# EAGLE design CH340E (EAGLE 9.6.2)
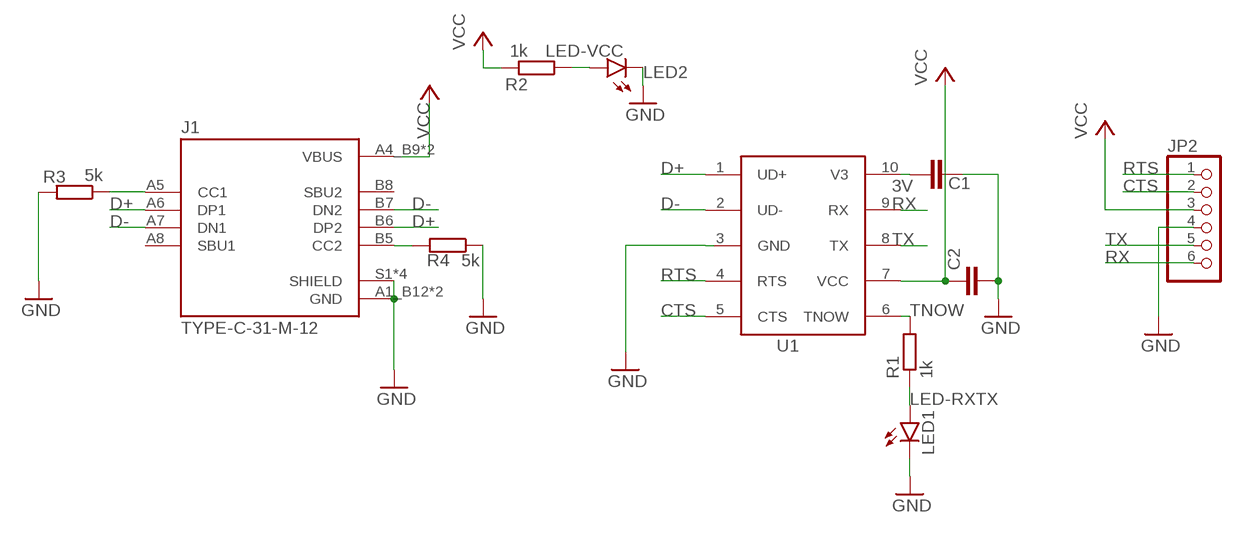
[diagram p0: schematic, sheet 1]

## Parts
C1  C-EUC0603  [C0603]
C2  C-EUC0603  [C0603]
J1  TYPE-C-31-M-12  [HRO_TYPE-C-31-M-12]
JP2  PINHD-1X6  [1X06]
LED1  LEDCHIPLED_0603  [CHIPLED_0603]
LED2  LEDCHIPLED_0603  [CHIPLED_0603]
R1  1k  R-EU_R0603  [R0603]
R2  1k  R-EU_R0603  [R0603]
R3  5k  R-EU_R0603  [R0603]
R4  5k  R-EU_R0603  [R0603]
U1  CH340ESMD  [MSOP10]

## Nets
3V: C1.1 U1.10(V3)
CTS: JP2.2 U1.5(CTS)
D+: J1.A6(DP1) J1.B6(DP2) U1.1(UD+)
D-: J1.A7(DN1) J1.B7(DN2) U1.2(UD-)
GND: C1.2 C2.2 J1.A1_B12(GND) J1.B1_A12(GND) J1.S1(SHIELD) J1.S2(SHIELD) J1.S3(SHIELD) J1.S4(SHIELD) JP2.4 LED1.C LED2.C R3.2 R4.1 U1.3(GND)
LED-RXTX: LED1.A R1.1
LED-VCC: LED2.A R2.1
N$1: J1.A5(CC1) R3.1
N$2: J1.B5(CC2) R4.2
RTS: JP2.1 U1.4(RTS)
RX: JP2.6 U1.9(RX)
TNOW: R1.2 U1.6(TNOW)
TX: JP2.5 U1.8(TX)
VCC: C2.1 J1.A4_B9(VBUS) J1.B4_A9(VBUS) JP2.3 R2.2 U1.7(VCC)
Unconnected: J1.A8(SBU1) J1.B8(SBU2)

## Library data of the parts
C1 C2 = rcl:C-EU: CAPACITOR, European symbol; SPICEPREFIX: C
J1 = TYPE-C-31-M-12:TYPE-C-31-M-12: Check availability <https://pricing.snapeda.com/parts/TYPE-C-31-M-12/HRO%20Electronics%20Co.%2C%20Ltd./view-part?ref=eda>; AVAILABILITY: Not in stock; DESCRIPTION: USB Connectors 24 Receptacle 1 8.94*7.3mm RoHS; MF: HRO Electronics Co., Ltd.; MP: TYPE-C-31-M-12; PACKAGE: Package; PRICE: None
JP2 = pinhead:PINHD-1X6: PIN HEADER
LED1 LED2 = led:LED: LED OSRAM: - CHIPLED LG R971, LG N971, LY N971, LG Q971, LY Q971, LO R971, LY R971 LH N974, LH R974 LS Q976, LO Q976, LY Q976 LO Q996 - Hyper CHIPLED LW Q18S LB Q993, LB Q99A, LB R99A - SideLED LS A670, LO A670, LY A670, LG A670, LP A670 LB A673, LV A673, LT A673, LW A673 LH A674 LY A675 LS A676, LA A676, LO A676, LY A676, LW A676 LS A679, LY A679, LG A679 - Hyper Micro SIDELED® LS Y876, LA Y876, LO Y876, LY Y876 LT Y87S - SmartLED LW L88C, LW L88S LB L89C, LB L89S, LG L890 LS L89K, LO L89K, LY L89K LS L896, LA L896, LO L896, LY L896 - TOPLED LS T670, LO T670, LY T670, LG T670, LP T670 LSG T670, LSP T670, LSY T670, LOP T670, LYG T670 LG T671, LOG T671, LSG T671 LB T673, LV T673, LT T673, LW T673 LH T674 LS T676, LA T676, LO T676, LY T676, LB T676, LH T676, LSB T676, LW T676 LB T67C, LV T67C, LT T67C, LS T67K, LO T67K, LY T67K, LW E67C LS E67B, LA E67B, LO E67B, LY E67B, LB E67C, LV E67C, LT E67C LW T67C LS T679, LY T679, LG T679 LS T770, LO T770, LY T770, LG T770, LP T770 LB T773, LV T773, LT T773, LW T773 LH T774 LS E675, LA E675, LY E675, LS T675 LS T776, LA T776, LO T776, LY T776, LB T776 LHGB T686 LT T68C, LB T68C - Hyper Mini TOPLED® LB M676 - Mini TOPLED Santana® LG M470 LS M47K, LO M47K, LY M47K Source: http://www.osram.convergy.de LUXEON: - LUMILED® LXK2-PW12-R00, LXK2-PW12-S00, LXK2-PW14-U00, LXK2-PW14-V00 LXK2-PM12-R00, LXK2-PM12-S00, LXK2-PM14-U00 LXK2-PE12-Q00, LXK2-PE12-R00, LXK2-PE12-S00, LXK2-PE14-T00, LXK2-PE14-U00 LXK2-PB12-K00, LXK2-PB12-L00, LXK2-PB12-M00, LXK2-PB14-N00, LXK2-PB14-P00, LXK2-PB14-Q00 LXK2-PR12-L00, LXK2-PR12-M00, LXK2-PR14-Q00, LXK2-PR14-R00 LXK2-PD12-Q00, LXK2-PD12-R00, LXK2-PD12-S00 LXK2-PH12-R00, LXK2-PH12-S00 LXK2-PL12-P00, LXK2-PL12-Q00, LXK2-PL12-R00 Source: www.luxeon.com KINGBRIGHT: KA-3528ASYC Source: www.kingbright.com
R1-R4 = rcl:R-EU_: RESISTOR, European symbol; SPICEPREFIX: R
U1 = CH340E:CH340E: WCH.CN/CH340E See DataSheet： wch.cn <http://www.wch.cn/downloads/CH340DS1_PDF.html>

## Board
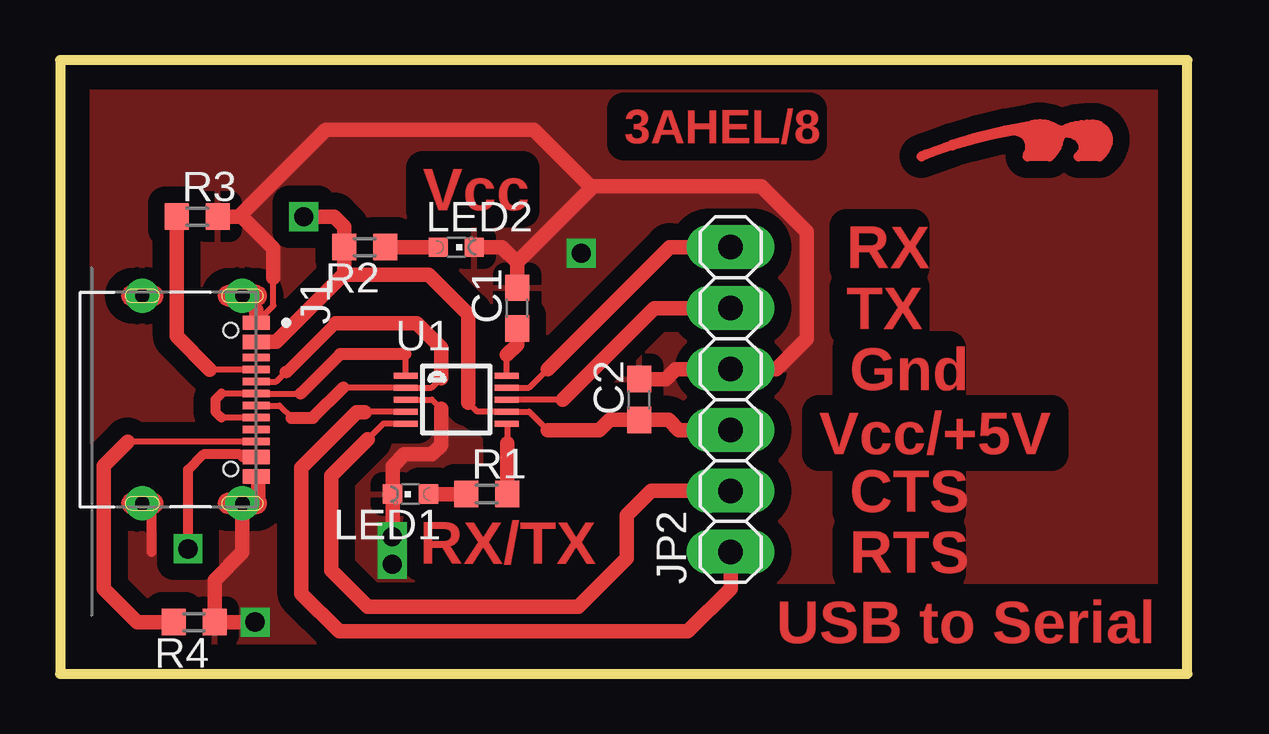
[diagram p1: board, top side]
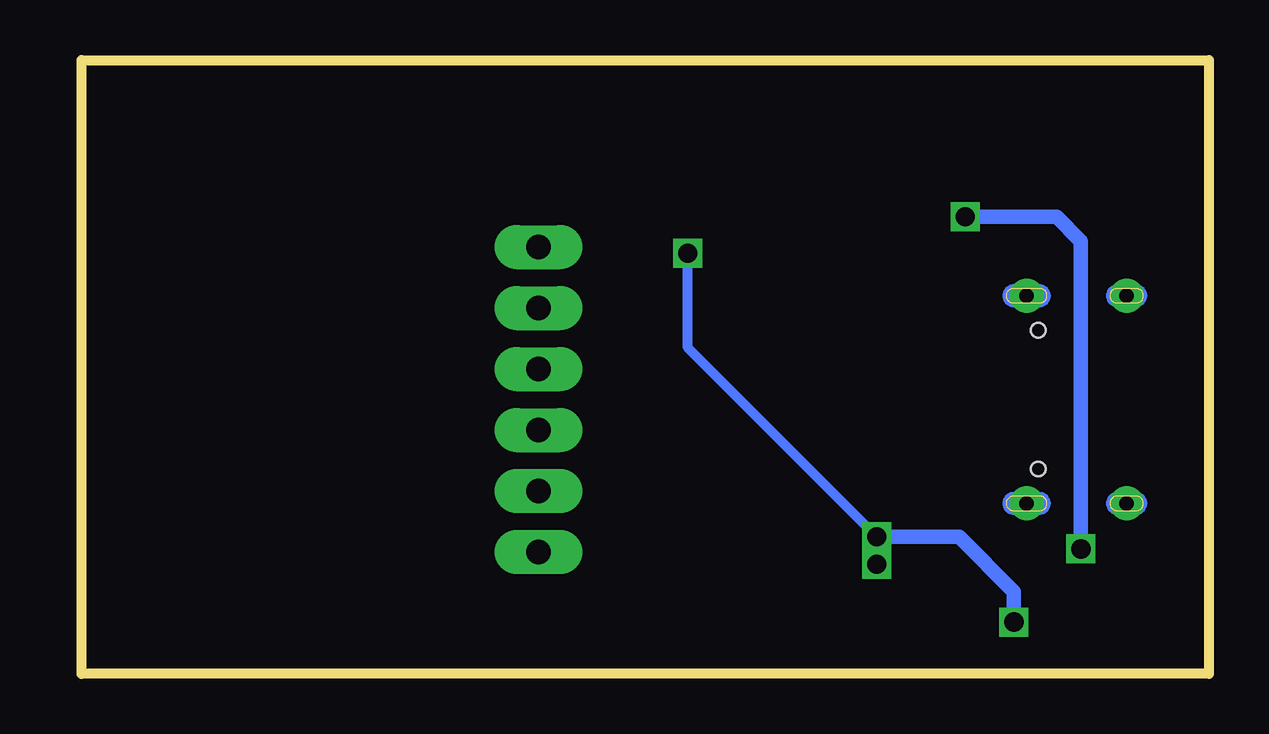
[diagram p2: board, bottom side, seen from below]

Size 46.97 x 25.58 mm. Coordinates in mm from the lower left corner, seen from the top.
Outline: 0,0 46.97,0 46.97,25.58 0,25.58 0,0
Copper layers (1*16): Top 0.035mm / dielectric 1.5mm / Bottom 0.035mm
Design rules "htl-klu *": minimum track width 16mil, minimum drill 0.35mm, track to track 8mil, track to pad 8mil, pad to pad 8mil, via to via 8mil, smd to smd 6mil, copper to edge 40mil, drill to drill 6mil, minimum pad ring 16mil, minimum via ring 8mil, stop-mask expansion 4mil, vias tented up to drill 0mil, thermal gap 20mil

### Footprints (pad centres in the part's own frame; a part is rotated, then mirrored left to right if it is on the bottom)
C0603 = smd 1.1 x 1: 1 -0.85,0; 2 0.85,0
HRO_TYPE-C-31-M-12 = smd 0.6 x 1.14: A1_B12 -3.2,4.75; A4_B9 -2.4,4.75; B1_A12 3.2,4.75; B4_A9 2.4,4.75 | smd 0.3 x 1.14: A5 -1.25,4.75; A6 -0.25,4.75; A7 0.25,4.75; A8 1.25,4.75; B5 1.75,4.75; B6 0.75,4.75; B7 -0.75,4.75; B8 -1.75,4.75 | drill 0.6 pad 0.9: S1 -4.325,4.17; S2 4.325,4.17; S3 -4.325,0; S4 4.325,0 | hole 0.6: -2.89,3.68; 2.89,3.68
1X06 = drill 1.016 long: 1 -6.35,0; 2 -3.81,0; 3 -1.27,0; 4 1.27,0; 5 3.81,0; 6 6.35,0
CHIPLED_0603 = smd 0.8 x 0.8: A 0,-0.75; C 0,0.75
R0603 = smd 1 x 1.1: 1 -0.85,0; 2 0.85,0
MSOP10 = smd 1 x 0.25: 1 -2.113,1; 2 -2.113,0.5; 3 -2.113,0; 4 -2.113,-0.5; 5 -2.113,-1; 6 2.113,-1; 7 2.113,-0.5; 8 2.113,0; 9 2.113,0.5; 10 2.113,1

### Placement (x,y rotation side)
C1  19.05,15.24 90 top
C2  24.13,11.43 90 top
J1  3.43,11.43 270 top
JP2  27.94,11.43 90 top
LED1  14.61,7.49 90 top
LED2  16.51,17.78 270 top
R1  17.78,7.49 0 top
R2  12.7,17.78 180 top
R3  5.71,19.05 0 top
R4  5.59,2.16 180 top
U1  16.51,11.43 0 top
U$2  [LOGOTOP_8]  41.15,21.59 0 top

### Tracks (layer width: path | path; a pad name or v marks a point on that pad's centre or on a via)
3V
  Top 0.254: U1.10 18.62,13.29
  Top 0.61: C1.1 19.05,13.72 18.62,13.29
CTS
  Top 0.254: U1.5 13.48,10.43 12.83,9.78
  Top 0.61: 12.83,9.78 11.3,8.26 11.3,4.32 12.83,2.79 21.59,2.79 23.62,4.83 23.62,6.6 24.64,7.62 JP2.2
D+
  Top 0.254: 10.03,11.68 J1.A6 6.73,11.68 | J1.B6 6.72,10.68 | U1.1 14.4,13.32
  Top 0.406: 6.72,10.68 6.48,10.92 6.48,11.43 6.73,11.68
  Top 0.508: 14.4,13.32 11.67,13.32 10.03,11.68
D-
  Top 0.254: J1.A7 9.14,11.18 9.65,10.67 | 11.8,11.93 U1.2 15.49,11.93 15.88,12.32 | J1.B7 9.01,12.18 9.4,12.57
  Top 0.508: 9.65,10.67 10.54,10.67 11.8,11.93 | 11.49,14.61 9.46,12.57 9.4,12.57
  Top 0.61: 11.49,14.61 14.86,14.61 15.88,13.59 15.88,12.32
GND  (via drill 0.8)
  Top 0.254: J1.A1_B12 8.89,15.34 8.89,16.51 | U1.3 15.49,11.43 15.88,11.05
  Top 0.406: J1.S2 7.73,7.24 8.26,7.24 | J1.S4 3.81,6.72 3.81,5.08
  Top 0.508: v13.84,5.71 v13.84,4.57
  Top 0.61: C1.2 19.05,17.14 | 19.05,17.14 18.41,17.78 LED2.C | C2.2 25.23,12.28 25.65,12.7 JP2.4 29.84,12.7 31.11,13.97 31.11,18.41 29.21,20.32 22.22,20.32 | 15.88,11.05 15.88,9.53 15.49,9.14 14.35,9.14 13.86,8.65 LED1.C 13.86,5.73 v13.84,5.71 | 22.22,20.32 19.05,17.14 | 8.89,16.51 8.89,17.74 7.58,19.05 R3.2 7.45,19.05 11.08,22.68 19.73,22.68 22.09,20.32 22.22,20.32 | J1.A1_B12 8.18,15.18 J1.S1 | J1.B1_A12 8.26,8.15 8.26,7.24 | 7.6,6.92 7.6,5.06 6.44,3.9 R4.1 v8.13,2.16
  Bottom 0.406: v21.72,17.53 21.72,13.59 v13.84,5.71
  Bottom 0.61: v8.13,2.16 8.13,3.43 10.41,5.71 v13.84,5.71
  pour Top (isolate 0.7): 0,25.4 46.99,25.4 46.99,0 0,0
LED-RXTX
  Top 0.61: R1.1 LED1.A
LED-VCC
  Top 0.61: LED2.A R2.1
N$1
  Top 0.254: J1.A5 6.24,12.68
  Top 0.61: R3.1 4.87,14.06 6.24,12.68
N$2
  Top 0.254: J1.B5 2.82,9.68
  Top 0.61: R4.2 3.21,2.16 1.82,3.56 1.82,8.68 2.82,9.68
RTS
  Top 0.254: U1.4 12.73,10.93 12.7,10.9
  Top 0.61: JP2.1 27.94,3.56 26.16,1.78 11.63,1.78 10.06,3.35 10.06,8.59 12.36,10.9 12.7,10.9
RX
  Top 0.254: U1.9 19.55,11.93 20.32,12.7
  Top 0.61: JP2.6 25.4,17.78 20.32,12.7
TNOW
  Top 0.254: U1.6 18.63,9.61
  Top 0.61: 18.63,9.61 R1.2
TX
  Top 0.254: 20.95,11.43 U1.8
  Top 0.61: 20.95,11.43 24.77,15.24 JP2.5
VCC  (via drill 0.8)
  Top 0.254: 20.32,10.16 19.55,10.93 U1.7 17.39,10.93 17.02,11.3
  Top 0.406: J1.B4_A9 7.61,9.03 7.49,9.14 5.97,9.14 5.33,8.51 v5.33,5.21
  Top 0.61: J1.A4_B9 9,13.83 11.85,16.68 | 11.85,16.68 11.85,16.64 15.37,16.64 17.02,14.99 17.02,11.3 | 11.85,16.68 R2.2 11.85,18.63 11.43,19.05 v10.16,19.05 | JP2.3 25.78,10.16 25.36,10.58 C2.1 22.9,10.58 22.48,10.16 20.32,10.16
  Bottom 0.61: v5.33,5.21 5.33,18.04 6.35,19.05 | v10.16,19.05 6.35,19.05 | 6.35,19.05

### Text on the board
Top: 3AHEL/8 | Vcc | RX | TX | Gnd | Vcc/+5V | CTS | RX/TX | RTS | USB to Serial